# Altium schematic sheet Main.SchDoc
size 420 x 297 mm; Address1: Address1; Address2: Address2; Address3: Address3; Address4: Address4; SheetNumber: 1; Scale: 1:1; Разраб.: Иванов; Обозначение документа: АБВГ.123456.001 Э3; Пров.: Петров; Утв.: Сидоров; Наименование организации: ОАО "Концерн "МПО-Гидроприбор"; Перв. применение: АБВГ.123456.000; Наименование изделия 1: Плата; Наименование изделия 2: Схема электрическая; Наименование изделия 3: принципиальная; Нач. отд.: Нач. отд.; Фамилия нач. отд.: Сидоров
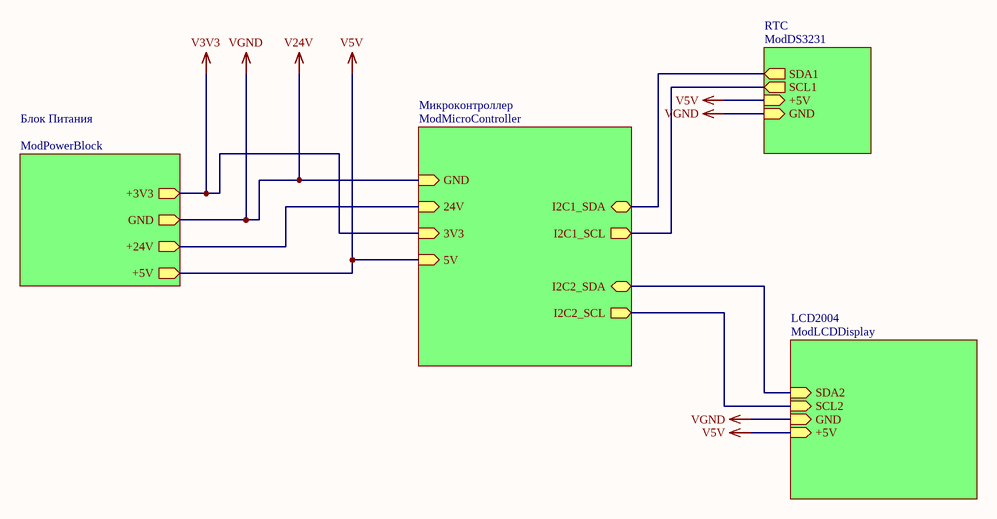
[diagram p0: Main.SchDoc]

## Sub-sheets
LCD2004 = ModLCDDisplay: SDA2 (in), SCL2 (in), GND (in), +5V (in)
RTC = ModDS3231: SDA1 (out), SCL1 (out), +5V (in), GND (in)
Блок Питания = ModPowerBlock: +3V3 (out), GND (out), +24V (out), +5V (out)
Микроконтроллер = ModMicroController: GND (in), 24V (in), I2C1_SDA, I2C1_SCL (out), 3V3 (in), 5V (in), I2C2_SDA, I2C2_SCL (out)

## Nets
V3V3: sheet Микроконтроллер/3V3, sheet Блок Питания/+3V3
V5V: sheet Микроконтроллер/5V, sheet RTC/+5V, sheet LCD2004/+5V, sheet Блок Питания/+5V
V24V: sheet Микроконтроллер/GND, sheet RTC/GND, sheet LCD2004/GND, sheet Блок Питания/GND  [also labelled VGND]
(unnamed): sheet Микроконтроллер/24V, sheet Блок Питания/+24V
(unnamed): sheet Микроконтроллер/I2C1_SDA, sheet RTC/SDA1
(unnamed): sheet Микроконтроллер/I2C1_SCL, sheet RTC/SCL1
(unnamed): sheet Микроконтроллер/I2C2_SDA, sheet LCD2004/SDA2
(unnamed): sheet Микроконтроллер/I2C2_SCL, sheet LCD2004/SCL2

## Notes on the sheet
- Перв. примен.
- Справ. №
- Подп. и дата
- Инв. № дубл.
- Взам. инв. №
- Разраб.
- Изм.
- Лист
- № докум.
- Подп.
- Дата
- Лит.
- Масса
- Масштаб
- Пров.
- Т.контр.
- Листов
- Инв. № подл.
- Утв.
- Н.контр.
- Копировал
- Формат А3